# EAGLE design Node1v2 (EAGLE 8.5.1)
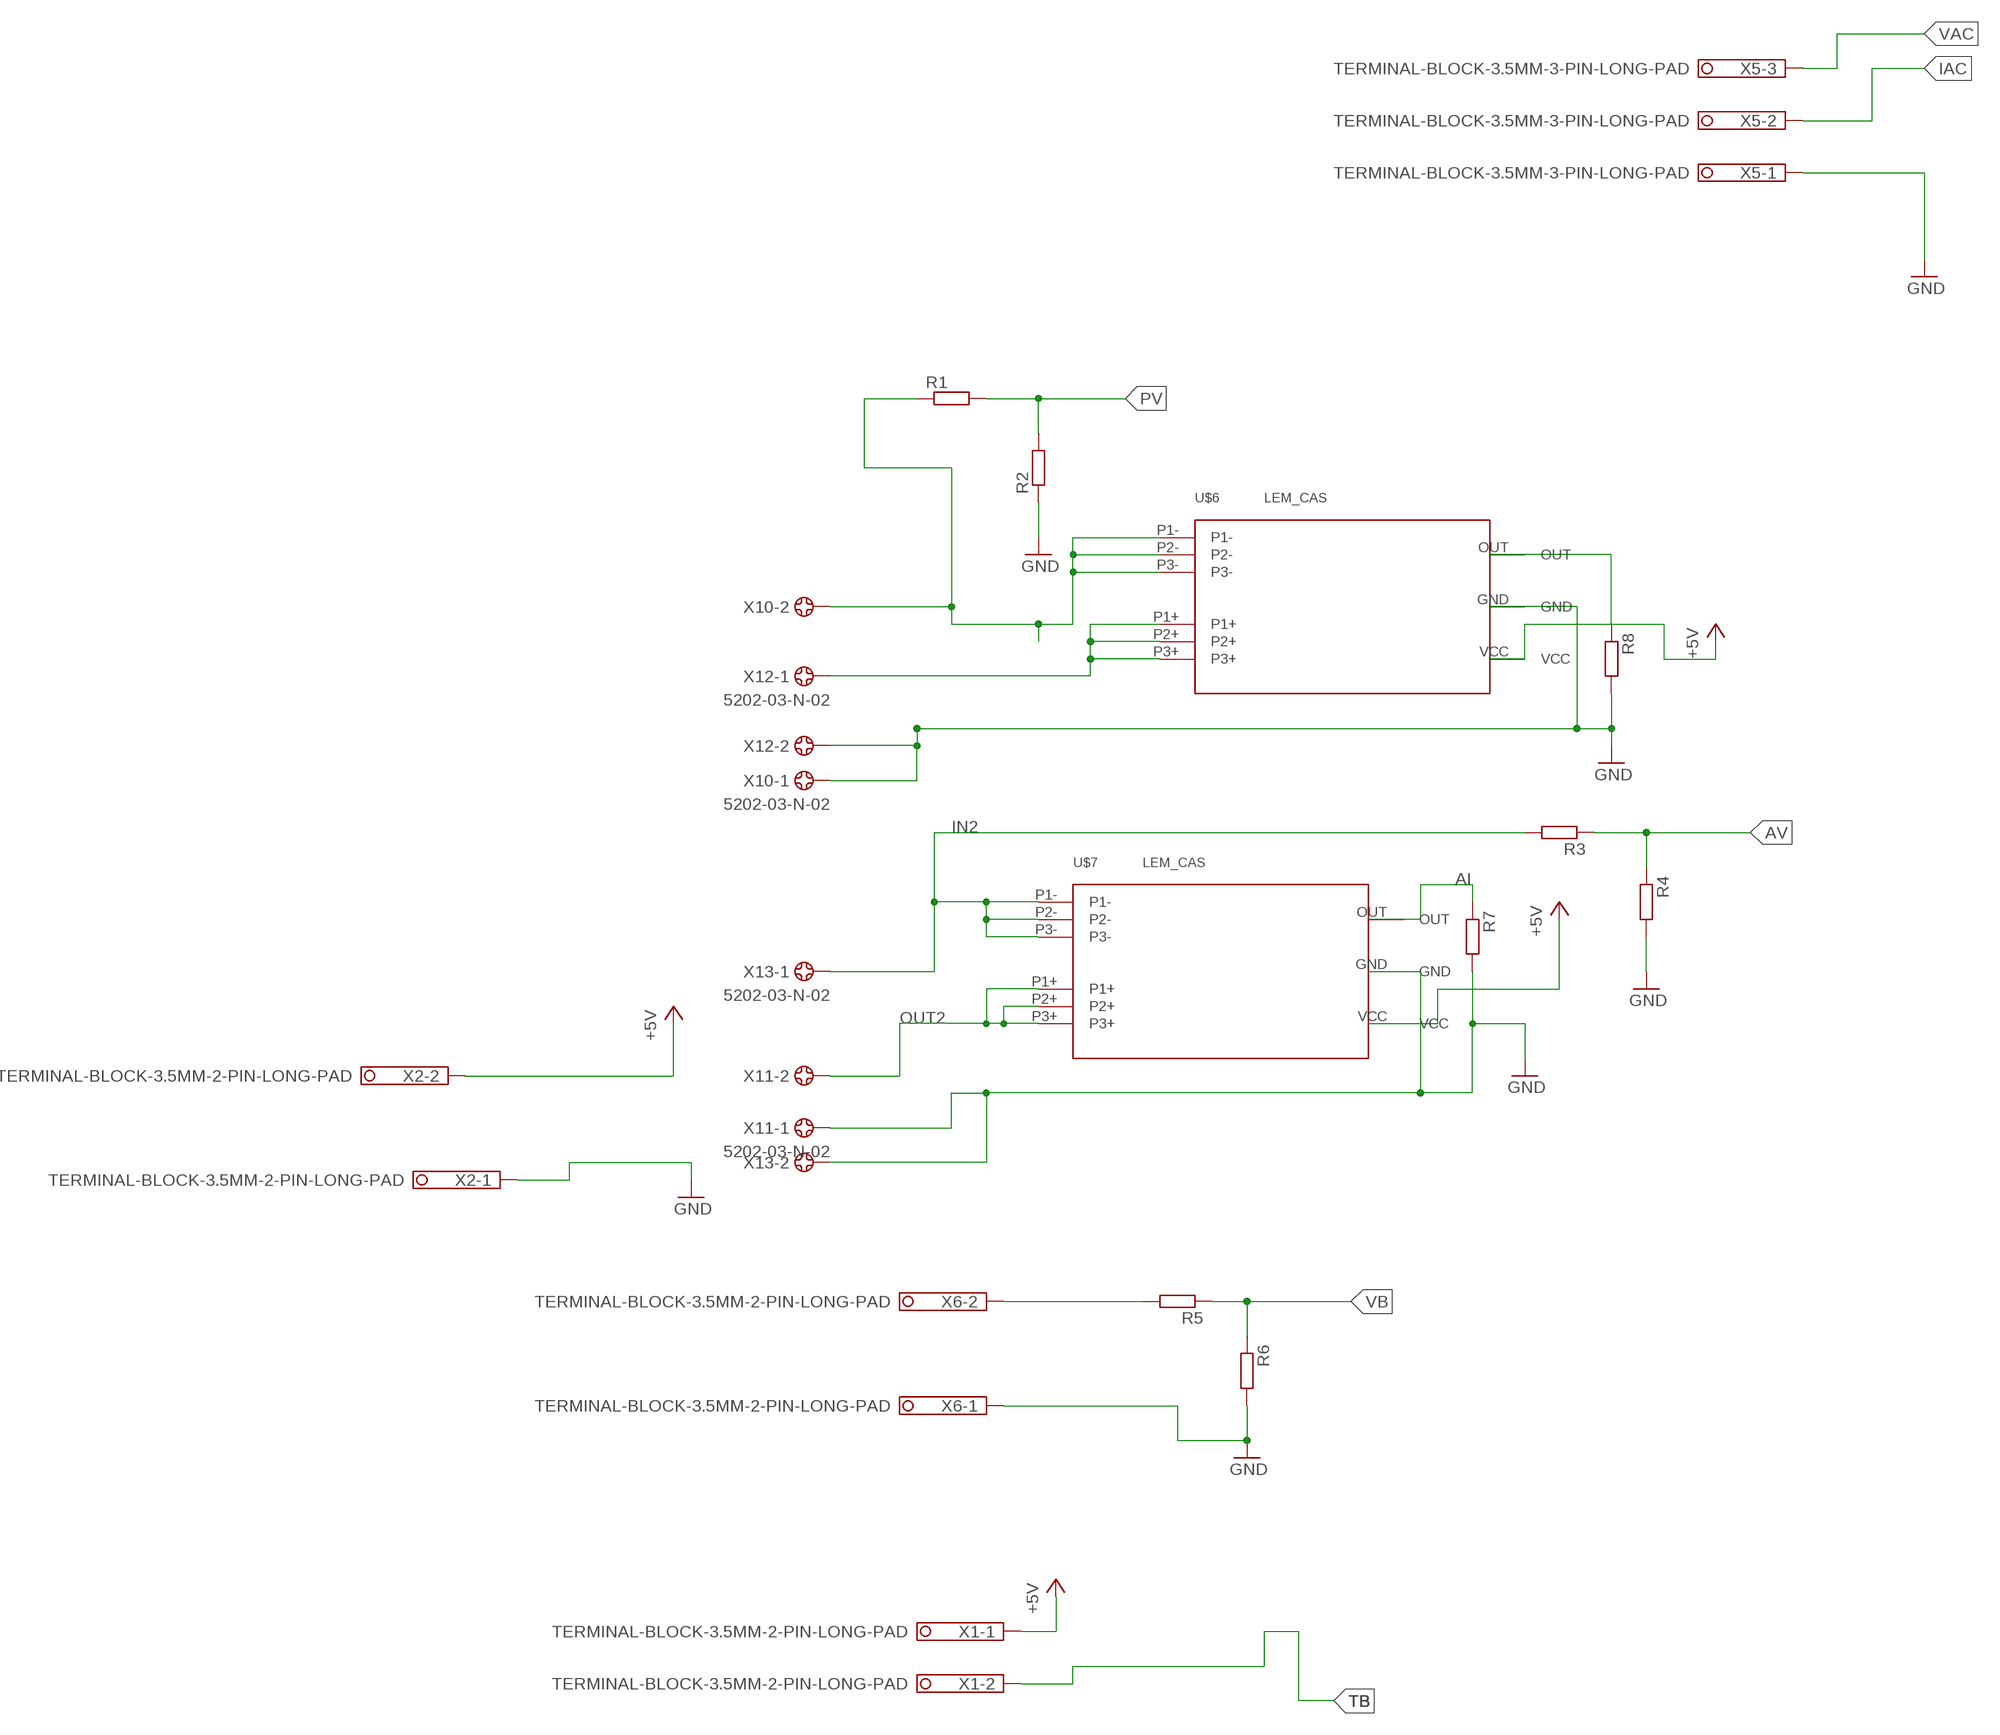
[diagram p0: schematic, sheet 1, part 1 of 2]
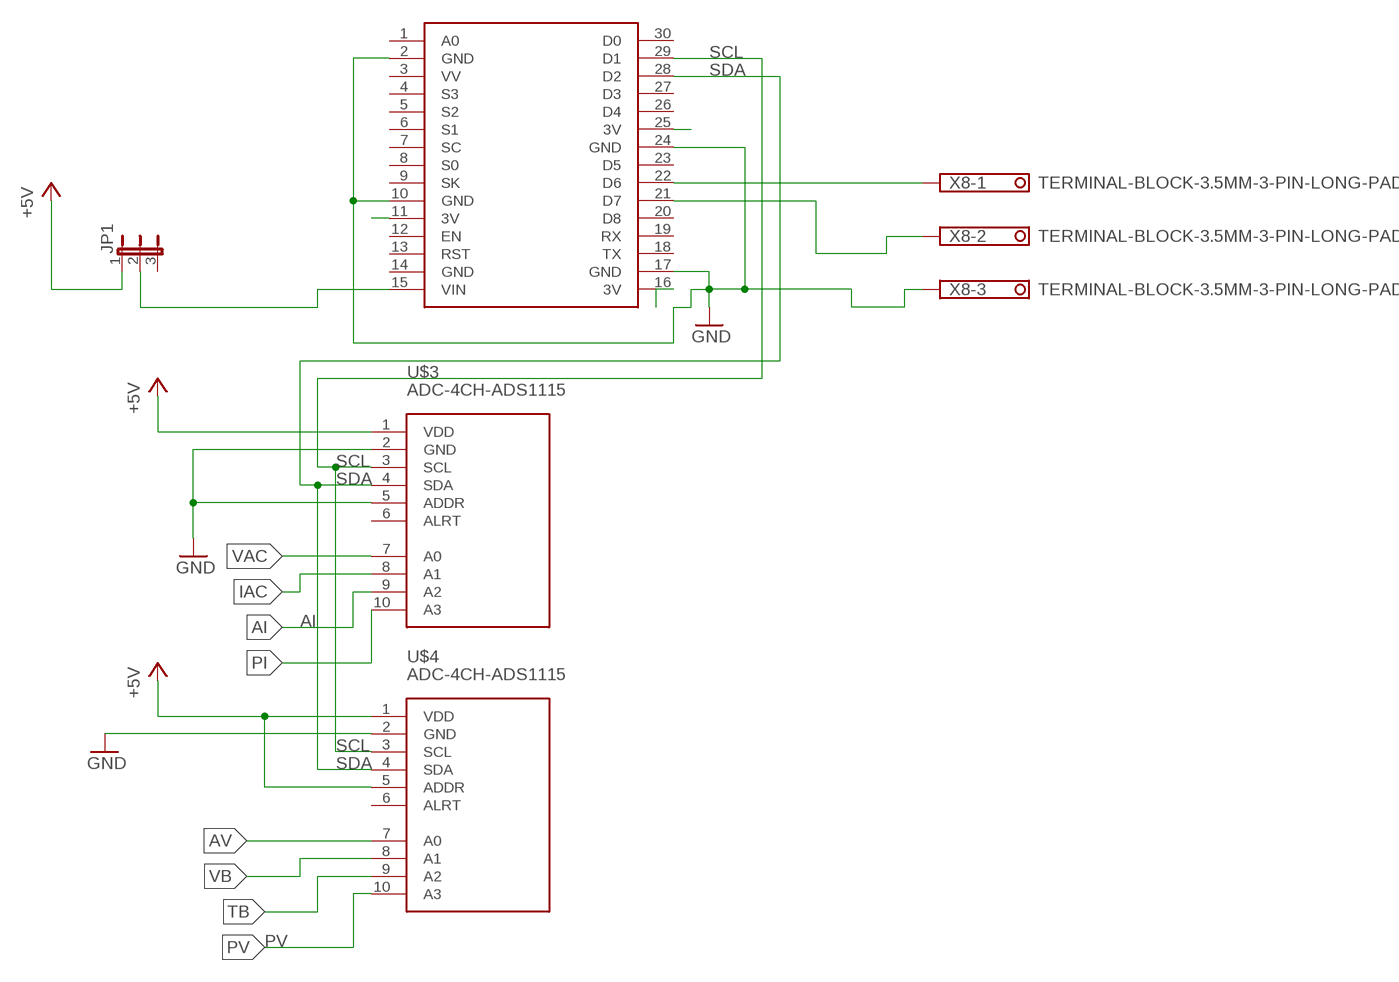
[diagram p1: schematic, sheet 1, part 2 of 2]

## Parts
JP1  JP2E  [JP2]
R1  R-EU_0207/12  [0207/12]
R2  R-EU_0207/12  [0207/12]
R3  R-EU_0207/12  [0207/12]
R4  R-EU_0207/12  [0207/12]
R5  R-EU_0207/12  [0207/12]
R6  R-EU_0207/12  [0207/12]
R7  R-EU_0207/12  [0207/12]
R8  R-EU_0207/12  [0207/12]
U$3  ADC-4CH-ADS1115  [ADC-4CH-ADS1115]
U$4  ADC-4CH-ADS1115  [ADC-4CH-ADS1115]
U$5  NODEMCU  [NODEMCU]
U$6  LEM_CAS  [LEMCAS]
U$7  LEM_CAS  [LEMCAS]
X1  TERMINAL-BLOCK-3.5MM-2-PIN-LONG-PAD  [TERMINAL-BLOCK-2-PIN-3.5MM-LONG-PAD]
X2  TERMINAL-BLOCK-3.5MM-2-PIN-LONG-PAD  [TERMINAL-BLOCK-2-PIN-3.5MM-LONG-PAD]
X5  TERMINAL-BLOCK-3.5MM-3-PIN-LONG-PAD  [TERMINAL-BLOCK-3-PIN-3.5MM-LONG-PAD]
X6  TERMINAL-BLOCK-3.5MM-2-PIN-LONG-PAD  [TERMINAL-BLOCK-2-PIN-3.5MM-LONG-PAD]
X8  TERMINAL-BLOCK-3.5MM-3-PIN-LONG-PAD  [TERMINAL-BLOCK-3-PIN-3.5MM-LONG-PAD]
X10  5202-03-N-02  [5202-03-N-02]
X11  5202-03-N-02  [5202-03-N-02]
X12  5202-03-N-02  [5202-03-N-02]
X13  5202-03-N-02  [5202-03-N-02]

## Nets
+5V: JP1.1 U$3.1(VDD) U$4.1(VDD) U$4.5(ADDR) U$6.VCC U$7.VCC X1.1 X2.2
AI: R7.1 U$3.9(A2) U$7.OUT
AV: R3.1 R4.1 U$3.10(A3)
GND: R2.1 R4.2 R6.2 R7.2 R8.2 U$3.2(GND) U$3.5(ADDR) U$4.2(GND) U$5.2(GND) U$5.10(GND) U$5.17(GND) U$5.24(GND) U$6.GND U$7.GND X2.1 X5.1 X6.1 X8.3 X10.1 X11.1 X12.2 X13.2
IAC: U$3.8(A1) X5.2
IN: R1.1 U$6.P1- U$6.P2- U$6.P3- X10.2
IN2: R3.2 U$7.P1- U$7.P2- U$7.P3- X13.1
N$3: U$5.22(D6) X8.1
N$5: R5.2 X6.2
N$6: U$5.21(D7) X8.2
N$7: U$5.16(3V)
N$10: U$5.11(3V)
N$11: U$5.25(3V)
N$40: JP1.2 U$5.15(VIN)
OUT: U$6.P1+ U$6.P2+ U$6.P3+ X12.1
OUT2: U$7.P1+ U$7.P2+ U$7.P3+ X11.2
PI: R8.1 U$4.7(A0) U$6.OUT
PV: R1.2 R2.2 U$4.10(A3)
SCL: U$3.3(SCL) U$4.3(SCL) U$5.29(D1)
SDA: U$3.4(SDA) U$4.4(SDA) U$5.28(D2)
TB: U$4.9(A2) X1.2
VAC: U$3.7(A0) X5.3
VB: R5.1 R6.1 U$4.8(A1)
Unconnected: JP1.3 U$3.6(ALRT) U$4.6(ALRT) U$5.1(A0) U$5.3(VV) U$5.4(S3) U$5.5(S2) U$5.6(S1) U$5.7(SC) U$5.8(S0) U$5.9(SK) U$5.12(EN) U$5.13(RST) U$5.18(TX) U$5.19(RX) U$5.20(D8) U$5.23(D5) U$5.26(D4) U$5.27(D3) U$5.30(D0)

## Power pins joined to a net without a drawn wire
GND: U$5.14(GND)

## Library data of the parts
JP1 = jumper:JP2E: JUMPER
R1-R8 = rcl:R-EU_: RESISTOR, European symbol; SPICEPREFIX: R
U$3 U$4 = diy-modules:ADC-4CH-ADS1115: 4 Channel 16-Bit Analog-to-Digital Converter based on ADS1115 chip Arduino ADS1115 Getting Started Tutorial is available here: http://henrysbench.capnfatz.com/henrys-bench/arduino-voltage-measurements/arduino-ads1115-module-getting-started-tutorial/ ADS1115 datasheet is available here: http://www.ti.com/lit/ds/symlink/ads1115.pdf Click here to find device on ebay.com <http://www.ebay.com/sch/ads1115+module>
U$5 = nodemcu:NODEMCU
U$6 U$7 = LEM_CAS:LEM_CAS
X1 X2 X6 = Rembrandt Electronics - Terminal Block 3-5mm v1-0:TERMINAL-BLOCK-3.5MM-2-PIN: Terminal Block 3.5mm Pitch: 3,5 mm Number of pins: 2 Created by Rembrandt Electronics www.rembrandtelectronics.com
X5 X8 = Rembrandt Electronics - Terminal Block 3-5mm v1-0:TERMINAL-BLOCK-3.5MM-3-PIN: Terminal Block 3.5mm Pitch: 3,5 mm Number of pins: 3 Created by Rembrandt Electronics www.rembrandtelectronics.com
X10-X13 = buchanna2:5202-03-N-02: Barrier Blocks Sreies 5202 Source: http://www.ebyelectro.com/PDF/5202-XX-N-02.pdf; OC_FARNELL: unknown; OC_NEWARK: unknown

## Board
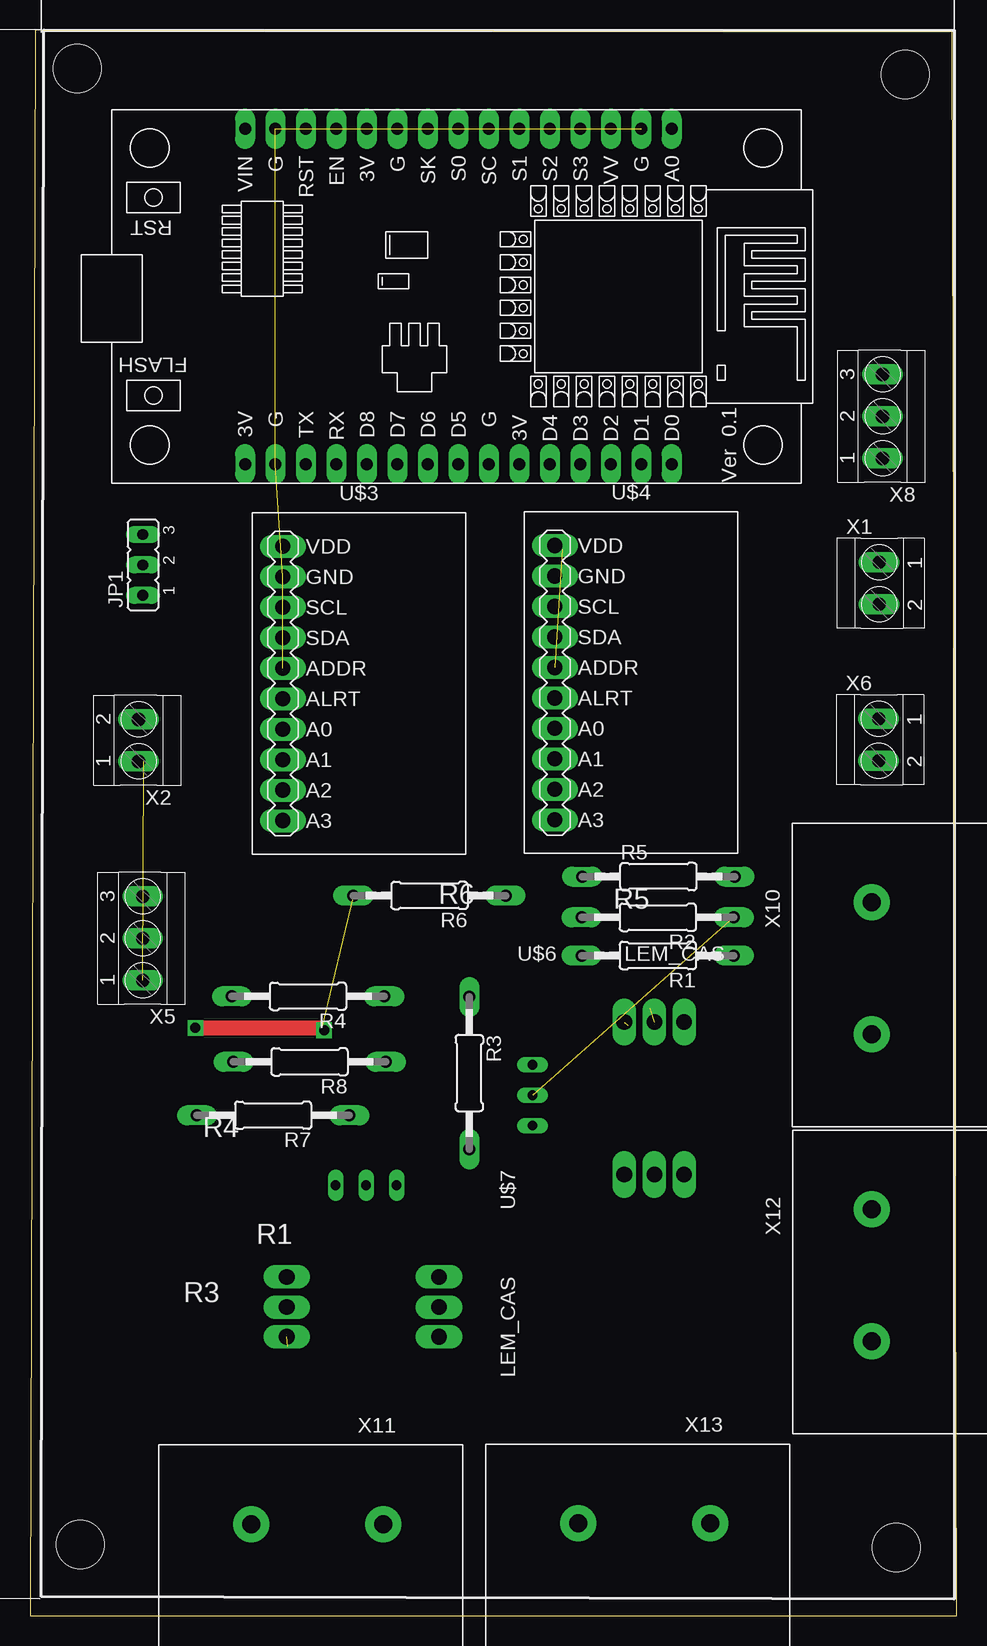
[diagram p2: board, top side]
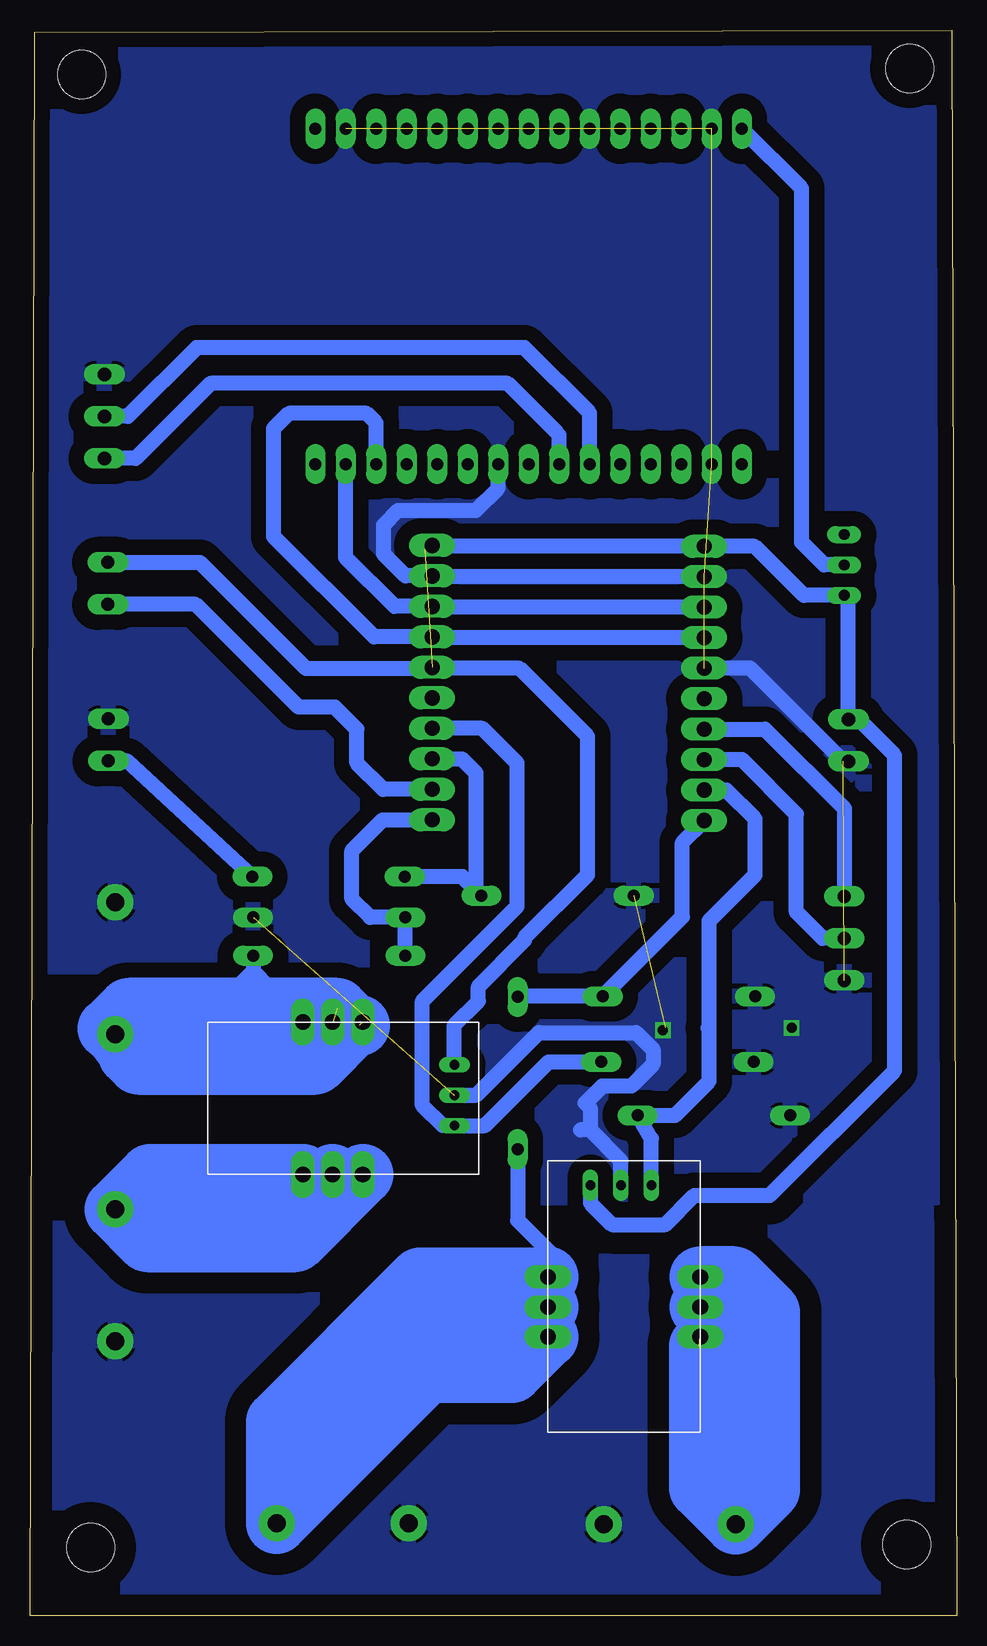
[diagram p3: board, bottom side, seen from below]

Size 77.25 x 132.15 mm. Coordinates in mm from the lower left corner, seen from the top.
Outline: 76.84,131.95 0.45,132.15 0,0 77.25,0 76.84,131.95
Copper layers (1*16): Top 0.035mm / dielectric 1.5mm / Bottom 0.035mm
Design rules "default": minimum track width 6mil, minimum drill 0.35mm, track to track 6mil, track to pad 6mil, pad to pad 6mil, via to via 6mil, smd to smd 6mil, copper to edge 40mil, drill to drill 6mil, minimum pad ring 10mil, minimum via ring 8mil, stop-mask expansion 4mil, vias tented up to drill 0mil, thermal gap 10mil
Holes 4 mm at 72.95,128.45 3.95,128.95 72.2,5.7 4.2,5.95

### Footprints (pad centres in the part's own frame; a part is rotated, then mirrored left to right if it is on the bottom)
JP2 = drill 0.914 long: 1 -2.54,0; 2 0,0; 3 2.54,0
0207/12 = drill 1 pad 1.676 long: 1 -6.35,0; 2 6.35,0
ADC-4CH-ADS1115 = drill 1.27 pad 1.778 long: 1 -6.35,11.43; 2 -6.35,8.89; 3 -6.35,6.35; 4 -6.35,3.81; 5 -6.35,1.27; 6 -6.35,-1.27; 7 -6.35,-3.81; 8 -6.35,-6.35; 9 -6.35,-8.89; 10 -6.35,-11.43
NODEMCU = drill 1 pad 1.676 long: 1 -13.97,17.78; 2 -13.97,15.24; 3 -13.97,12.7; 4 -13.97,10.16; 5 -13.97,7.62; 6 -13.97,5.08; 7 -13.97,2.54; 8 -13.97,0; 9 -13.97,-2.54; 10 -13.97,-5.08; 11 -13.97,-7.62; 12 -13.97,-10.16; 13 -13.97,-12.7; 14 -13.97,-15.24; 15 -13.97,-17.78; 16 13.97,-17.78; 17 13.97,-15.24; 18 13.97,-12.7; 19 13.97,-10.16; 20 13.97,-7.62; 21 13.97,-5.08; 22 13.97,-2.54; 23 13.97,0; 24 13.97,2.54; 25 13.97,5.08; 26 13.97,7.62; 27 13.97,10.16; 28 13.97,12.7; 29 13.97,15.24; 30 13.97,17.78
LEMCAS = drill 0.8 pad 1.27 long: GND -10.16,0.254; OUT -10.16,-2.286; VCC -10.16,2.794 | drill 1.3 pad 1.93 long: P1+ -2.52,-6.35; P1- -2.52,6.35; P2+ 0,-6.35; P2- 0,6.35; P3+ 2.47,-6.35; P3- 2.47,6.35
TERMINAL-BLOCK-2-PIN-3.5MM-LONG-PAD = drill 1.1 pad 1.7 long: 1 -1.75,-0.1; 2 1.75,-0.1
TERMINAL-BLOCK-3-PIN-3.5MM-LONG-PAD = drill 1.1 pad 1.7 long: 1 -3.5,-0.1; 2 0,-0.1; 3 3.5,-0.1
5202-03-N-02 = drill 1.5 pad 3: 1 -11,0; 2 0,0

### Placement (x,y rotation side)
JP1  9.4,87.57 90 top
R1  52.32,55.02 180 top
R2  52.32,58.21 180 top
R3  36.61,45.23 270 top
R4  23.17,51.63 180 top
R5  52.37,61.6 0 top
R6  33.29,60.02 180 top
R7  20.26,41.71 180 top
R8  23.3,46.17 180 top
U$3  27.42,77.7 0 top
U$4  50.09,77.76 0 top
U$5  35.7,109.95 270 top
U$6  52.04,43.13 0 top
U$7  27.75,25.72 270 top
X1  70.86,86.04 270 top
X2  8.95,72.95 90 top
X5  9.29,56.45 90 top
X6  70.82,73 270 top
X8  70.95,99.95 90 top
X10  70.13,48.46 270 top
X11  18.45,7.63 180 top
X12  70.16,22.86 270 top
X13  45.7,7.7 180 top

### Tracks (layer width: path | path; a pad name or v marks a point on that pad's centre or on a via)
+5V  (1 unrouted)
  Bottom 0.813: 9.05,84.67 JP1.1 | 43.67,89.13 U$4.1
  Bottom 1.27: 43.82,78.96 36.45,78.96 30.78,73.29 30.78,61.75 36.05,56.49 36.05,56.29 39.89,52.44 39.89,51.22 41.88,49.24 U$6.VCC | 43.82,78.96 44.35,78.96 54.26,78.96 63.1,87.79 X1.1 | 43.82,78.96 U$4.5 | 44.35,88.87 44.09,89.13 43.67,89.13 U$3.1 16.87,89.13 12.77,85.03 JP1.1 | 9.05,84.67 X2.2 8.2,74.7 5.2,71.7 5.2,45.44 15.6,35.03 21.88,35.03 24.31,32.6 28.76,32.6 30.54,34.39 U$7.VCC
AI
  Bottom 1.27: 20.74,49 20.66,49 | 20.66,49 20.66,57.9 16.82,61.75 16.82,66.41 19.22,68.81 U$3.9 | U$7.OUT 25.46,39.76 R7.1 23.5,41.71 20.66,44.55 20.66,49
AV
  Bottom 1.27: R3.1 36.56,51.62 R4.1 22.89,58.25 22.89,64.45 U$3.10
GND  (via drill 0.85 pad 1.3)  (8 unrouted)
  Top 1.27: v13.78,49 24.31,49 v24.51,48.8
  Bottom 1.27: U$3.2 43.67,86.59 U$4.2 45.97,86.65 47.79,88.47 47.79,90.9 46.57,92.11 40.1,92.11 38.24,93.97 U$5.24 | X2.1 9.46,71.2 17.24,78.97 U$3.5 | U$6.GND 40.04,43.38 34.83,48.59 26.74,48.59 25.32,47.18 25.32,45.96 27.14,44.14 29.57,44.14 30.99,42.72 30.58,42.32 30.58,40.5 | U$7.GND 28,37.92 30.58,40.5 | 30.58,40.5 31.39,40.5
  pour Bottom (isolate 1.27): 3.46,34.63 42.73,34.83 43.74,33.82 43.74,53.86 43.54,54.06 76.93,54.06 76.93,131.58 76.33,132.19 1.64,132.19 0.83,131.38 1.23,34.83
  pour Bottom (isolate 1.778): -0.99,1.63 76.73,1.43 77.14,1.03 77.14,53.05 77.54,53.45 46.78,53.45 45.36,52.03 45.36,34.22 43.74,33.41 -0.18,35.03
IAC
  Bottom 0.813: U$3.8 20.07,71.57 | 13.2,58.45 13.2,64.7
  Bottom 1.27: X5.2 11.2,56.45 13.2,58.45 13.38,58.63 13.38,66.81 17.91,71.35 U$3.8
IN  (2 unrouted)
  Bottom 1.27: 58.92,51.02 58.51,50.62 | 57.91,52.24 58.51,52.84 59.53,52.84 58.67,53.71 | R1.1 58.67,53.71 | 58.67,53.71 57.4,52.44 57.3,52.44 55.33,50.46 55.33,48.66
  Bottom 5.08: X10.2 55.33,48.66 U$6.P3- | X10.2 69.04,46.97 69.04,46.77 68.23,45.96 53.45,45.96 50.22,49.2 | 49.81,49.2 50.22,49.2 | X10.2 70.73,48.92 69.04,50.62 58.51,50.62 51.63,50.62 50.22,49.2
IN2
  Bottom 1.27: R3.2 36.61,32.96 33.42,29.77 34.19,29 34.19,28.15
  Bottom 5.08: U$7.P3- 37.09,20.26 44.14,20.26 X13.1 | X13.1 56.7,16.2 44.75,28.15 34.19,28.15 U$7.P1- | U$7.P2- 34.43,25.72 36.86,23.29 45.16,23.29 56.7,11.75 X13.1
N$3
  Bottom 0.813: 33.16,98.41 33.28,98.53
  Bottom 1.27: U$5.22 33.16,98.41 | 33.28,98.53 37.45,102.7 62.2,102.7 68.45,96.45 X8.1
N$5
  Bottom 1.27: R5.2 69.18,71.25 X6.2
N$6
  Bottom 1.27: U$5.21 30.62,100.24 36.05,105.67 63.37,105.67 69.1,99.95 X8.2
N$40
  Bottom 1.27: JP1.2 11.07,87.57 12.95,89.45 12.95,118.95 U$5.15
OUT
  Bottom 5.08: X12.1 67.48,31.19 55.11,31.19 U$6.P1+ | X12.1 67.24,36.78 U$6.P3+ | U$6.P2+ 54.95,33.86 X12.1
OUT2  (1 unrouted)
  Bottom 5.08: 21.47,22.48 21.47,10.66 X11.2 | X11.2 15.6,10.48 15.6,25.32 18.53,28.24 U$7.P1+ | U$7.P2+ 18.45,22.77 X11.2
PI
  Bottom 0.813: U$4.7 43.13,73.95 | 43.13,73.95 41.96,73.96 | 43.13,73.95 39.55,73.95
  Bottom 1.27: R8.1 34.02,46.16 39.35,40.84 U$6.OUT 42.87,40.84 44.55,42.52 44.55,51.22 36.65,59.12 36.65,71.06 39.55,73.95 U$4.7
PV
  Bottom 1.27: R1.2 R2.2 48.9,58.21 50.42,59.73 50.42,63.77 47.86,66.33 U$4.10
SCL
  Bottom 0.813: 45.12,84.12 U$4.3
  Bottom 1.27: U$3.3 43.67,84.05 U$4.3 46.87,84.11 50.94,88.18 U$5.29
SDA
  Bottom 0.813: 45.04,81.58 U$4.4
  Bottom 1.27: U$3.4 43.67,81.51 U$4.4 48.58,81.57 56.95,89.94 56.95,98.95 55.69,100.21 49.2,100.21 48.4,99.4 U$5.28
TB
  Bottom 1.27: U$4.9 47.82,68.87 50.01,71.06 50.01,73.89 51.84,75.72 54.87,75.72 63.44,84.29 X1.2
VAC
  Bottom 1.27: U$3.7 16,73.89 9.39,67.28 X5.3
VB
  Bottom 1.27: R5.1 41.22,61.6 R6.1 40.1,60.48 40.1,70.25 41.26,71.41 U$4.8

### Text on the board
tPlace: R6 | R5 | R4 | R1 | R3
tTest: ON | - | 5V | BAT | GND | + | - | V | I | PANEL | GND | + | - | AERO | + | PANEL | - | - | AERO | + | +
tSilk: ON | OFF | Panel | Panel